# Altium schematic sheet Sheet5.SchDoc
size A4
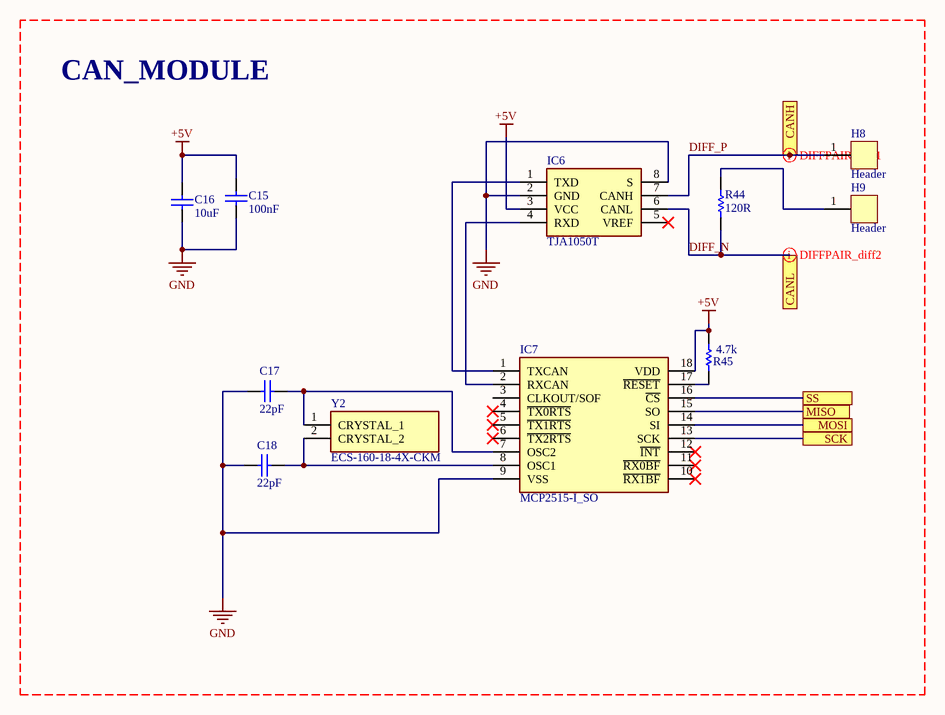
[diagram p0: Sheet5.SchDoc]

## Parts
C15  100nF  [KEMT-1206-2_N]
C16  10uF  [KEMT-1206-2_N]
C17  22pF  [KEMT-1206-2_N]
C18  22pF  [KEMT-1206-2_N]
H8  Header  [Header]
H9  Header  [Header]
IC6  TJA1050T  [SOIC127P600X175-8N]
IC7  MCP2515-I_SO  [SOIC127P1030X265-18N]
R44  120R  [R1206]
R45  4.7k  [R1206]
Y2  ECS-160-18-4X-CKM  [ECS160184XCKM]

## Blocks framed on the sheet
CAN_MODULE: C15-C18 H8 H9 IC6 IC7 R44 R45 Y2

## Ports
CANH, CANL, MISO, MOSI, SCK, SS

## Nets
+5V: C15.1 C16.1 IC6.3(VCC) IC7.18(VDD) R45.1
GND: C15.2 C16.2 C17.2 C18.2 IC6.2(GND) IC6.8(S) IC7.9(VSS)
DIFF_N: IC6.6(CANL) R44.1 ; port CANL
DIFF_P: H8.1 IC6.7(CANH) ; port CANH
MISO: IC7.15(SO) ; port MISO
MOSI: IC7.14(SI) ; port MOSI
SCK: IC7.13(SCK) ; port SCK
SS: IC7.16(~{CS}) ; port SS
NetC17_1: C17.1 IC7.7(OSC2) Y2.1(CRYSTAL_1)
NetC18_1: C18.1 IC7.8(OSC1) Y2.2(CRYSTAL_2)
NetH9_1: H9.1 R44.2
NetIC6_1: IC6.1(TXD) IC7.1(TXCAN)
NetIC6_4: IC6.4(RXD) IC7.2(RXCAN)
NetIC7_17: IC7.17(~{RESET}) R45.2

Not connected (* = marked no-connect by the designer): IC6 5(VREF)*; IC7 3(CLKOUT/SOF) 4(~{TX0RTS})* 5(~{TX1RTS})* 6(~{TX2RTS})* 10(~{RX1BF})* 11(~{RX0BF})* 12(~{INT})*

## Layout directives
differential pair; differential pair class *: DIFF_N, DIFF_P

## Library data of the parts
C15-C18 = CMP-1037-04202-2: CAP, Ceramic, 0.1 uF, +/- 10%, 50 V, -55 to 125 degC, 1206 (3216 Metric), RoHS, Tape and Reel; Manufacturer: Kemet; Voltage Rating: 50V; Capacitance: 0.1µF; Product Range: KEMET-CSeries; SVHC: ToBeAdvised; Dielectric Characteristic: X7R; Capacitor Case Style: 1206[3216Metric]; Package Reference: 1206-2; Package Description: 2-Leads SMD, Body 3.2 x 1.6 mm; Packaging: Tape&Reel; Operating Temperature Max: 125degC; Capacitance Tolerance: ±10%; Datasheet URL: https://datasheet.ciiva.com/6125/1725438-6125494.pdf; Manufacturer URL: http://www.kemet.com/; Operating Temperature Min: -55degC; Datasheet Version: Jul-13
IC6 = TJA1050T: Integrated Circuit; Manufacturer_Name: Nexperia; Datasheet Link: http://docs-emea.rs-online.com/webdocs/0425/0900766b80425301.pdf; Height: 1.75mm; Manufacturer_Part_Number: TJA1050T; Mouser Part Number: N/A; Mouser Price/Stock: https://www.mouser.com/Search/Refine.aspx?Keyword=N%2FA
IC7 = MCP2515-I_SO: Integrated Circuit; Manufacturer_Name: Microchip; Manufacturer_Part_Number: MCP2515-I/SO; Datasheet Link: http://ww1.microchip.com/downloads/en/DeviceDoc/21801G.pdf; Height: 2.65mm; Mouser Part Number: 579-MCP2515-I/SO; Mouser Price/Stock: https://www.mouser.co.uk/ProductDetail/Microchip-Technology/MCP2515-I-SO?qs=KwArPi4cUogGDbGnphOvtQ%3D%3D; Arrow Part Number: MCP2515-I/SO; Arrow Price/Stock: https://www.arrow.com/en/products/mcp2515-iso/microchip-technology?region=nac
R44 R45 = RES: Part Number: CRCW120647K0FKEA; Manufacturer: Vishay Dale
Y2 = ECS-160-18-4X-CKM: Crystal or Oscillator; Manufacturer_Name: ECS; Datasheet Link: https://www.mouser.be/datasheet/2/122/hc-49usx-791.pdf; Height: 3.5mm; Manufacturer_Part_Number: ECS-160-18-4X-CKM; Mouser Part Number: 520-ECS160-18-4X-CKM; Mouser Price/Stock: https://www.mouser.co.uk/ProductDetail/ECS/ECS-160-18-4X-CKM?qs=7MVldsJ5UawYqyimirccKw%3D%3D